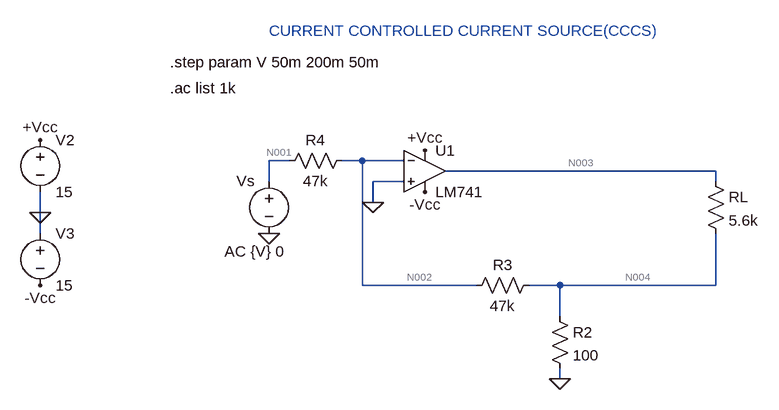
[diagram p0: schematic CCCS.asc]
CCCS.asc, the LTspice schematic file:
Version 4
SHEET 1 880 680
WIRE -80 128 -112 128
WIRE 32 128 0 128
WIRE 96 128 32 128
WIRE 576 144 160 144
WIRE -112 160 -112 128
WIRE 96 160 48 160
WIRE 576 160 576 144
WIRE 48 192 48 160
WIRE -464 208 -464 176
WIRE -464 240 -464 208
WIRE 32 320 32 128
WIRE 208 320 32 320
WIRE 336 320 288 320
WIRE 576 320 576 240
WIRE 576 320 336 320
WIRE 336 368 336 320
WIRE 336 464 336 448
FLAG -464 208 0
FLAG -112 240 0
FLAG 336 464 0
FLAG 48 192 0
FLAG 128 112 +Vcc
FLAG 128 176 -Vcc
FLAG -464 96 +Vcc
FLAG -464 320 -Vcc
SYMBOL Opamps\\LM741 128 80 R0
SYMATTR InstName U1
SYMATTR SpiceModel ""
SYMBOL res 560 144 R0
SYMATTR InstName RL
SYMATTR Value 5.6k
SYMBOL res 320 352 R0
SYMATTR InstName R2
SYMATTR Value 100
SYMBOL res 304 304 R90
WINDOW 0 0 56 VBottom 2
WINDOW 3 32 56 VTop 2
SYMATTR InstName R3
SYMATTR Value 47k
SYMBOL res 16 112 R90
WINDOW 0 0 56 VBottom 2
WINDOW 3 32 56 VTop 2
SYMATTR InstName R4
SYMATTR Value 47k
SYMBOL voltage -112 144 R0
WINDOW 0 -50 15 Left 2
WINDOW 3 -68 96 Left 2
WINDOW 123 -68 124 Left 2
WINDOW 39 0 0 Left 2
SYMATTR InstName Vs
SYMATTR Value ""
SYMATTR Value2 AC {V} 0
SYMBOL voltage -464 80 R0
SYMATTR InstName V2
SYMATTR Value 15
SYMBOL voltage -464 224 R0
SYMATTR InstName V3
SYMATTR Value 15
TEXT -112 -72 Left 2 ;CURRENT CONTROLLED CURRENT SOURCE(CCCS)
TEXT -264 -24 Left 2 !.step param V 50m 200m 50m
TEXT -264 16 Left 2 !.ac list 1k

The netlist it stands for:
* CCCS.asc
XU1 0 N002 +Vcc -Vcc N003 LM741  ; pins In+ In- V+ V- OUT
RL N003 N004 5.6k
R2 N004 0 100
R3 N004 N002 47k
R4 N002 N001 47k
Vs N001 0 AC {V} 0
V2 +Vcc 0 15
V3 0 -Vcc 15
* CURRENT CONTROLLED CURRENT SOURCE(CCCS)
.step param V 50m 200m 50m
.ac list 1k
.lib LM741.lib
.backanno
.end

* Results of the author's LTspice run, read from the files saved beside the schematic
* Operating Point (first step), zero values left out:
*   v = 50 m
*   V(n003) = 387.3 mV
*   V(n004) = 6.783 mV
*   V(n002) = 998 µV
*   V(+vcc) = 15 V
*   V(-vcc) = -15 V
*   I(R4) = 21.23 nA
*   I(R3) = 123.1 nA
*   I(R2) = 67.83 µA
*   I(Rl) = 67.95 µA
*   I(V3) = -1.674 mA
*   I(V2) = -1.742 mA
*   I(Vs) = 21.23 nA
*   Ix(u1:1) = 57.86 nA
*   Ix(u1:2) = 101.9 nA
*   Ix(u1:99) = 1.742 mA
*   Ix(u1:50) = -1.674 mA
*   Ix(u1:28) = -67.95 µA
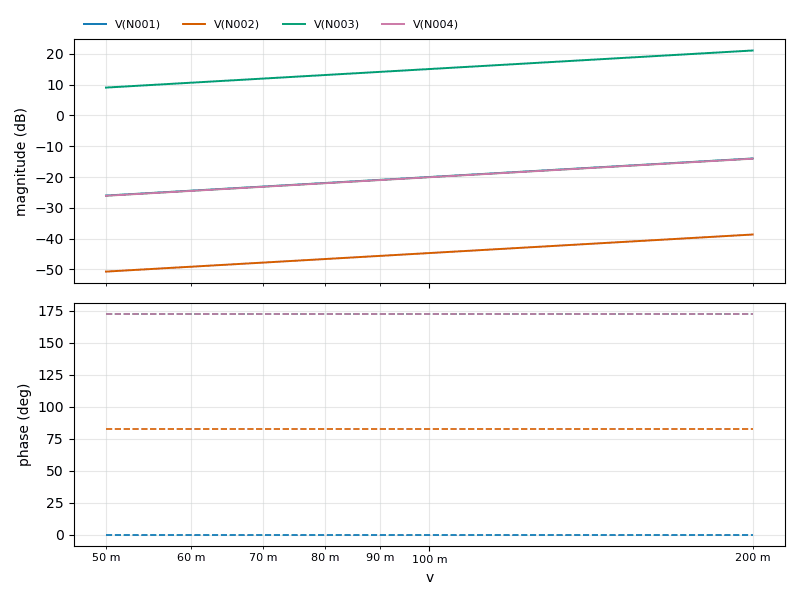
[diagram p1: AC Analysis of CCCS.asc, plotted from the saved traces]
* AC Analysis, 1 run:
*   V(N001): -26.02 dB at 50 mHz, -13.98 dB at 200 mHz, peak -13.98 dB at 200 mHz, 3 dB below the peak at 141.4 mHz
*   V(N002): -50.71 dB at 50 mHz, -38.67 dB at 200 mHz, peak -38.67 dB at 200 mHz, 3 dB below the peak at 141.4 mHz
*   V(N003): 9.04 dB at 50 mHz, 21.08 dB at 200 mHz, peak 21.08 dB at 200 mHz, 3 dB below the peak at 141.4 mHz
*   V(N004): -26.10 dB at 50 mHz, -14.05 dB at 200 mHz, peak -14.05 dB at 200 mHz, 3 dB below the peak at 141.4 mHz